# Altium project machhaap2out.PrjPcb
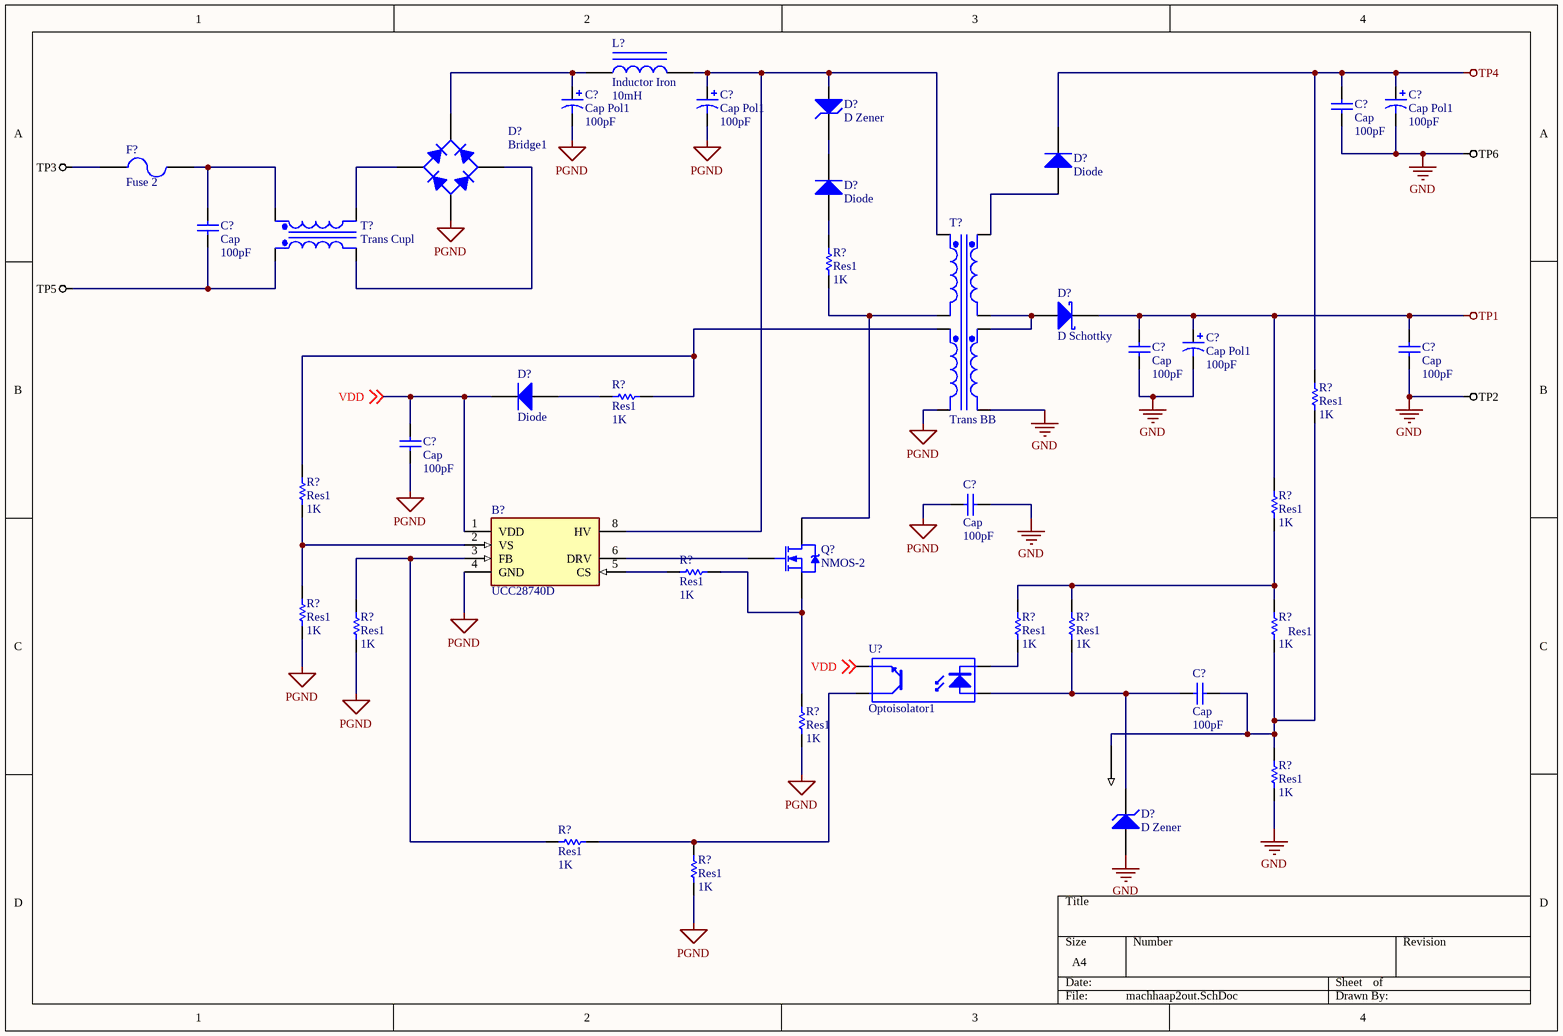
[diagram p0: machhaap2out.SchDoc]
1 sheet, 40 parts. Net scope: global (net labels, ports and power ports of the same name join across sheets).

## Sheet machhaap2out.SchDoc
size A4; SheetNumber: 1; SheetTotal: 1; SPICEModelCacheBPIWFBJJ: <root> / <DocumentId>BPIWFBJJ</DocumentId> / <CacheFrame Number="0"> / <Model Name="fuse" Kind="CKT"> / <Text>.SUBCKT FUSE 1 2 PARAMS: CURRENT=1 RESISTANCE=1m / SW1 1 2 3 0 SMOD OFF / BNLV 3 0 V=(abs(v(1,2))) / .MODEL SMOD SW (VT={(CURRENT*RESISTANCE)} RON=1g ROFF={RESISTANCE}) / .ENDS FUSE</Text> / </Model> / <Model Name="bridge" Kind="CKT"> / <Text>*Default Diode Bridge Rectifier / *Connections: / *              V- / *              | AC1 / *              | | V+ / *              | | | AC2 / *              | | | | / .SUBCKT BRIDGE 1 2 3 4 / D1 1 2 DMOD / D2 1 4 DMOD / D3 2 3 DMOD / D4 4 3 DMOD / .MODEL DMOD D () / .ENDS BRIDGE</Text> / </Model> / <Model Name="diode" Kind="MDL"> / <Text>*Default Diode / *Diode Pinout: A,K / .MODEL DIODE D()</Text> / </Model> / <Model Name="zener" Kind="MDL"> / <Text>*ZENER / *Default Zener 10V @ 10mA / *Zener Diode Pinout: A,K / .MODEL ZENER D( BV=10 IBV=10E-3 )</Text> / </Model> / <Model Name="skydiode" Kind="MDL"> / <Text>*Default Schottky Diode / *Schottky Diode Pinout: A,K / .MODEL SKYDIODE D(EG=0.69 XTI=2)</Text> / </Model> / <Model Name="ideal4w" Kind="CKT"> / <Text>*Ideal Transformer Subcircuit Parameters / *RATIO1 = turns ratio (= secondary1/primary) / *RATIO2 = turns ratio (= secondary2/primary) / *RATIO3 = turns ratio (= secondary3/primary) / * / *Ideal Transformer with four windings / *dw 18/12/00: created / *Connections: / *               Pri+ / *               | Pri- / *               | | Sec1+ / *               | | | Sec1- / *               | | | | Sec2+ / *               | | | | | Sec2- / *               | | | | | | Sec3+ / *               | | | | | | | Sec3- / *               | | | | | | | | / .SUBCKT IDEAL4W 1 2 3 4 5 6 7 8 PARAMS: RATIO1=1 RATIO2=1 RATIO3=1 / BP  1 2 I=( -I(BS1)*{RATIO1} - I(BS2)*{RATIO2} - I(BS3)*{RATIO3} ) / BS1 3 4 V=( V(1,2)*{RATIO1} ) / BS2 5 6 V=( V(1,2)*{RATIO2} ) / BS3 7 8 V=( V(1,2)*{RATIO3} ) / .ENDS IDEAL4W</Text> / </Model> / <Model Name="irf1010" Kind="CKT"> / <Text>*IRF1010 MCE 4-2-96 / *55V  75A .014 ohm HEXFET pkg:TO-220 2,1,3 / .SUBCKT IRF1010  10 20 40 40 / M1   1  2  3  3  DMOS L=1U W=1U / RD  10  1  5.65M / RS  30  3  1.35M / RG  20  2  12.1 / CGS  2  3  2.15N / EGD 12  0  2  1  1 / VFB 14  0  0 / FFB  2  1  VFB  1 / CGD 13 14  4.49N / R1  13  0  1 / D1  12 13  DLIM / DDG 15 14  DCGD / R2  12 15  1 / D2  15  0  DLIM / DSD  3 10  DSUB / LS  30 40  7.5N / .MODEL DMOS NMOS (LEVEL=3 THETA=60M VMAX=114K ETA=2M VTO=3 KP=19.4) / .MODEL DCGD D (CJO=4.49N VJ=.6 M=.68) / .MODEL DSUB D (IS=311N N=1.5 RS=8.67M BV=55 CJO=4.08N VJ=.8 M=.42 TT=100N) / .MODEL DLIM D (IS=100U) / .ENDS IRF1010</Text> / </Model> / </CacheFrame> / </root>

### Parts
(Parts that share a designator on the sheet are numbered #1, #2 ... from top to bottom, then left to right.)
B?  UCC28740D  [SOIC127P600X175-8N]
C?#1  Cap Pol1  value 100pF  [RB7.6-15]
C?#2  Cap Pol1  value 100pF  [RB7.6-15]
C?#3  Cap Pol1  value 100pF  [RB7.6-15]
C?#4  Cap  value 100pF  [RAD-0.3]
C?#5  Cap  value 100pF  [RAD-0.3]
C?#6  Cap Pol1  value 100pF  [RB7.6-15]
C?#7  Cap  value 100pF  [RAD-0.3]
C?#8  Cap  value 100pF  [RAD-0.3]
C?#9  Cap  value 100pF  [RAD-0.3]
C?#10  Cap  value 100pF  [RAD-0.3]
C?#11  Cap  value 100pF  [RAD-0.3]
D?#1  D Zener  [DIODE-0.7]
D?#2  Diode  [SMC]
D?#3  Bridge1  [D-38]
D?#4  Diode  [SMC]
D?#5  D Schottky  [SMB]
D?#6  Diode  [SMC]
D?#7  D Zener  [DIODE-0.7]
F?  Fuse 2  [PIN-W2/E2.8]
L?  Inductor Iron  value 10mH  [AXIAL-0.9]
Q?  NMOS-2  [TO-220AB]
R?#1  Res1  value 1K  [AXIAL-0.3]
R?#2  Res1  value 1K  [AXIAL-0.3]
R?#3  Res1  value 1K  [AXIAL-0.3]
R?#4  Res1  value 1K  [AXIAL-0.3]
R?#5  Res1  value 1K  [AXIAL-0.3]
R?#6  Res1  value 1K  [AXIAL-0.3]
R?#7  Res1  value 1K  [AXIAL-0.3]
R?#8  Res1  value 1K  [AXIAL-0.3]
R?#9  Res1  value 1K  [AXIAL-0.3]
R?#10  Res1  value 1K  [AXIAL-0.3]
R?#11  Res1  value 1K  [AXIAL-0.3]
R?#12  Res1  value 1K  [AXIAL-0.3]
R?#13  Res1  value 1K  [AXIAL-0.3]
R?#14  Res1  value 1K  [AXIAL-0.3]
R?#15  Res1  value 1K  [AXIAL-0.3]
T?#1  Trans BB  [TRF_8]
T?#2  Trans Cupl  [TRF_4]
U?  Optoisolator1  [DIP-4]

### Nets
GND: C?#3.2 C?#4.1 C?#6.2 C?#7.1 C?#8.1 C?#10.1 D?#7.1(A) R?#13.1 T?#1.8(Sec2-)  [also labelled TP2, TP6]
PGND: B?.4(GND) C?#1.2 C?#2.2 C?#9.2 C?#10.2 D?#3.3(A) R?#7.1 R?#8.1 R?#12.1 R?#15.2 T?#1.4(Pri2-)
TP1: C?#6.1 C?#7.2 C?#8.2 D?#5.2(K) R?#5.2
TP3: F?.1
TP4: C?#3.1 C?#4.2 D?#2.2(K) R?#3.2
TP5: C?#5.1 T?#2.1(Pri+)
 VDD: B?.1(VDD) C?#9.1 D?#6.2(K) U?.3(E) ; off-sheet VDD, off-sheet  VDD  [also labelled VDD]
NetB?_2: B?.2(VS) R?#4.1 R?#7.2
NetB?_3: B?.3(FB) R?#8.2 R?#14.1
NetB?_5: B?.5(CS) R?#6.2
NetB?_6: B?.6(DRV) Q?.1(G)
NetB?_8: B?.8(HV) C?#2.1 D?#1.1(A) L?.2 T?#1.1(Pri1+)
NetC?#1_1: C?#1.1 D?#3.1(K) L?.1
NetC?#5_2: C?#5.2 F?.2 T?#2.3(Sec+)
NetC?#11_1: C?#11.1 D?#7.0(REF) R?#3.1 R?#11.1 R?#13.2
NetC?#11_2: C?#11.2 D?#7.2(K) R?#10.1 U?.1(A)
NetD?#1_2: D?#1.2(K) D?#4.2(K)
NetD?#2_1: D?#2.1(A) T?#1.5(Sec1+)
NetD?#3_2: D?#3.2(C) T?#2.2(Pri-)
NetD?#3_4: D?#3.4(C) T?#2.4(Sec-)
NetD?#4_1: D?#4.1(A) R?#1.2
NetD?#5_1: D?#5.1(A) T?#1.6(Sec1-) T?#1.7(Sec2+)
NetD?#6_1: D?#6.1(A) R?#2.1
NetQ?_2: Q?.2(D) R?#1.1 T?#1.2(Pri1-)
NetQ?_3: Q?.3(S) R?#6.1 R?#12.2
NetR?#2_2: R?#2.2 R?#4.2 T?#1.3(Pri2+)
NetR?#5_1: R?#5.1 R?#9.2 R?#10.2 R?#11.2
NetR?#9_1: R?#9.1 U?.2(K)
NetR?#14_2: R?#14.2 R?#15.1 U?.4(C)

### Library data of the parts
B? = UCC28740D: Constant-Voltage, Constant-Current Flyback Controller Using Opto-Coupler Feedback; Manufacturer_Name: Texas Instruments; Geometry.Height: 1.75mm; Manufacturer_Part_Number: UCC28740D; Mouser Part Number: 595-UCC28740D; Mouser Price/Stock: https://www.mouser.co.uk/ProductDetail/Texas-Instruments/UCC28740D?qs=e1ok2LiJcmbAqvdvthXi7Q%3D%3D; Arrow Part Number: UCC28740D; Arrow Price/Stock: https://www.arrow.com/en/products/ucc28740d/texas-instruments?utm_currency=USD&region=europe; Datasheet Link: http://www.ti.com/lit/gpn/UCC28740
C?#1-C?#3 C?#6 = Cap Pol1: Polarized Capacitor (Radial); Published: 8-Jun-2000; LatestRevisionDate: 17-Jul-2002; LatestRevisionNote: Re-released for DXP Platform.; PackageReference: RB7.6-15; Publisher: Altium Limited; PackageDescription: Polarized Capacitor (Radial); 2 Leads
C?#4 C?#5 C?#7-C?#11 = Cap: Capacitor; Published: 8-Jun-2000; LatestRevisionDate: 17-Jul-2002; LatestRevisionNote: Re-released for DXP Platform.; PackageReference: RAD-0.3; Publisher: Altium Limited; PackageDescription: Radial Cap, Thru-Hole; 2 Leads; 0.3 in Pin Spacing
D?#1 D?#7 = D Zener: Zener Diode; Published: 8-Jun-2000; LatestRevisionDate: 17-Jul-2002; LatestRevisionNote: Re-released for DXP Platform.; PackageReference: DIODE-0.7; Publisher: Altium Limited; PackageDescription: Diode, Thru-Hole; 2 Leads; 0.7 in Pin Spacing
D?#2 D?#4 D?#6 = Diode: Default Diode; Published: 8-Jun-2000; LatestRevisionDate: 17-Jul-2002; LatestRevisionNote: Re-released for DXP Platform.; PackageVersion: Sep-1996; PackageReference: SMC; Publisher: Altium Limited; PackageDescription: DO-214-AB/SMC; 2 C-Bend Leads; Body 7.9 x 5.9 mm, inc. leads (LxW); Code_JEDEC: DO-214-AB
D?#3 = Bridge1: Full Wave Diode Bridge; Published: 8-Jun-2000; LatestRevisionDate: 29-May-2009; LatestRevisionNote: Sch pins A & K swapped.; DatasheetVersion: E2732B; PackageReference: D-38; Publisher: Altium Limited; PackageDescription: Bridge Rectifier; 4 Terminals; Body 9.4 x 9.4 mm (typ); Pitch 5.08 mm
D?#5 = D Schottky: Schottky Diode; Published: 8-Jun-2000; LatestRevisionDate: 17-Jul-2002; LatestRevisionNote: Re-released for DXP Platform.; PackageReference: SMB; Publisher: Altium Limited; PackageDescription: DO-214-AA/SMB; 2 C-Bend Leads; Body 5.3 x 3.6 mm, inc. leads (LxW); Code_JEDEC: DO-214-AA
F? = Fuse 2: Fuse; Published: 8-Jun-2000; LatestRevisionDate: 17-Jul-2002; LatestRevisionNote: Re-released for DXP Platform.; PackageReference: PIN-W2/E2.8; Publisher: Altium Limited; PackageDescription: Thru-Hole; 2 Leads
L? = Inductor Iron: Magnetic-Core Inductor; Published: 24-Mar-1999; LatestRevisionDate: 17-Jul-2002; LatestRevisionNote: Re-released for DXP Platform.; PackageReference: AXIAL-0.9; Publisher: Altium Limited; PackageDescription: Axial Device, Thru-Hole; 2 Leads; 0.9 in Pin Spacing
Q? = NMOS-2: N-Channel Power MOSFET; Note: Pin 2 is electrically connected to pin 4.; Published: 8-Jun-2000; LatestRevisionDate: 17-Jul-2002; LatestRevisionNote: Re-released for DXP Platform.; DatasheetVersion: PD-9.814; PackageVersion: Feb-1997; PackageReference: TO-220AB; Publisher: Altium Limited; PackageDescription: TO, Thru-Hole, Vertical, Heatsink Mounted; 3 In-Line Leads; Pitch 2.54 mm; ComponentLink1Description: Manufacturer Link; ComponentLink1URL: http://www.irf.com/
R?#1-R?#15 = Res1: Resistor; Published: 8-Jun-2000; LatestRevisionDate: 17-Jul-2002; LatestRevisionNote: Re-released for DXP Platform.; PackageReference: AXIAL-0.3; Publisher: Altium Limited; PackageDescription: Axial Device, Thru-Hole; 2 Leads; 0.3 in Pin Spacing
T?#1 = Trans BB: Buck-boost Transformer (Ideal); Published: 25-Jan-2001; LatestRevisionDate: 17-Jul-2002; LatestRevisionNote: Re-released for DXP Platform.; PackageReference: TRF_8; Publisher: Altium Limited; PackageDescription: Transformer; 8 Leads
T?#2 = Trans Cupl: Transformer (Coupled Inductor Model); Published: 8-Jun-2000; LatestRevisionDate: 17-Jul-2002; LatestRevisionNote: Re-released for DXP Platform.; PackageReference: TRF_4; Publisher: Altium Limited; PackageDescription: Transformer; 4 Leads
U? = Optoisolator1: 4-Pin Phototransistor Optocoupler; Published: 24-Mar-1999; LatestRevisionDate: 04-Mar-2005; LatestRevisionNote: Sch pins 3 & 4 Swapped.; DatasheetVersion: Nov-2003; PackageReference: DIP-4; Publisher: Altium Limited